# EAGLE design vrnding-mechine (EAGLE 9.5.1)
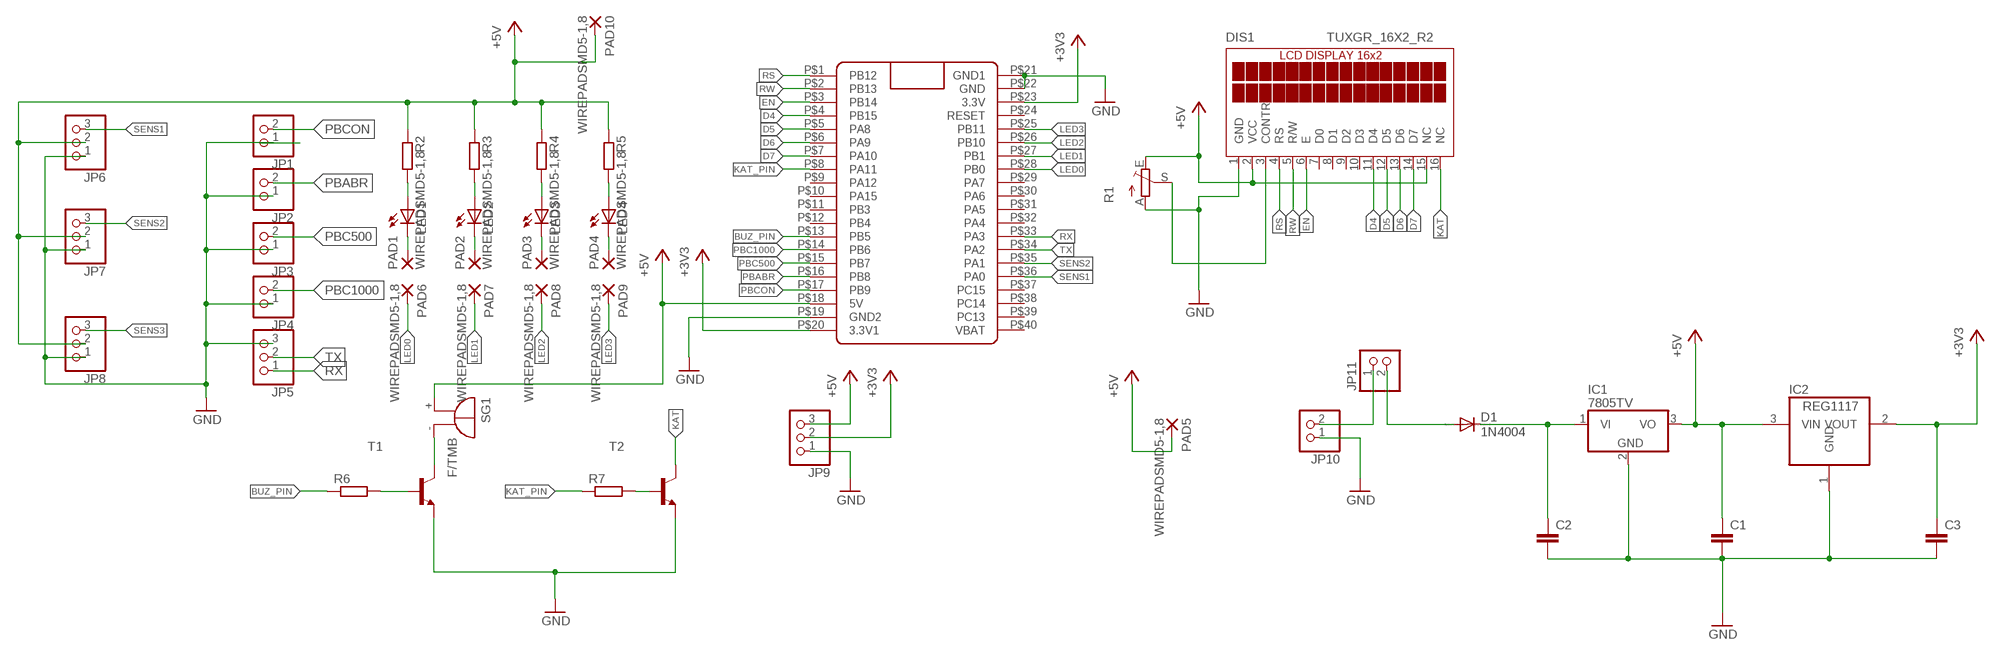
[diagram p0: schematic, sheet 1]

## Parts
C1  C-EU025-030X050  [C025-030X050]
C2  C-EU025-030X050  [C025-030X050]
C3  C-EU025-030X050  [C025-030X050]
D1  1N4004  [DO41-10]
DIS1  TUXGR_16X2_R2  [TUXGR_16X2_R2]
IC1  7805TV  [TO220V]
IC2  REG1117  [SOT223]
JP1  PINHD-1X2  [1X02]
JP2  PINHD-1X2  [1X02]
JP3  PINHD-1X2  [1X02]
JP4  PINHD-1X2  [1X02]
JP5  PINHD-1X3  [1X03]
JP6  PINHD-1X3  [1X03]
JP7  PINHD-1X3  [1X03]
JP8  PINHD-1X3  [1X03]
JP9  PINHD-1X3  [1X03]
JP10  PINHD-1X2  [1X02]
JP11  PINHD-1X2  [1X02]
LED1  LED5MM  [LED5MM]
LED2  LED5MM  [LED5MM]
LED3  LED5MM  [LED5MM]
LED4  LED5MM  [LED5MM]
PAD1  WIREPADSMD5-1,8  [5-1,8]
PAD2  WIREPADSMD5-1,8  [5-1,8]
PAD3  WIREPADSMD5-1,8  [5-1,8]
PAD4  WIREPADSMD5-1,8  [5-1,8]
PAD5  WIREPADSMD5-1,8  [5-1,8]
PAD6  WIREPADSMD5-1,8  [5-1,8]
PAD7  WIREPADSMD5-1,8  [5-1,8]
PAD8  WIREPADSMD5-1,8  [5-1,8]
PAD9  WIREPADSMD5-1,8  [5-1,8]
PAD10  WIREPADSMD5-1,8  [5-1,8]
R1  TRIM_EU-CA6V  [CA6V]
R2  R-EU_0309/10  [0309/10]
R3  R-EU_0309/10  [0309/10]
R4  R-EU_0309/10  [0309/10]
R5  R-EU_0309/10  [0309/10]
R6  R-EU_0309/10  [0309/10]
R7  R-EU_0309/10  [0309/10]
SG1  F/TMB  [F/TMB]
T1  -NPN-TO92-ECB  [TO92-ECB]
T2  -NPN-TO92-ECB  [TO92-ECB]
U$1  BLUE_PILL  [BLUE_PILL]

## Nets
+3V3: C3.1 IC2.2(VOUT) JP9.2 U$1.P$20(3.3V1) U$1.P$23(3.3V)
+5V: C1.1 DIS1.2(VCC) DIS1.15(NC) IC1.3(VO) IC2.3(VIN) JP6.2 JP7.2 JP8.2 JP9.3 PAD5.1(P) PAD10.1(P) R1.E R2.1 R3.1 R4.1 R5.1 SG1.+ U$1.P$18(5V)
BUZ_PIN: R6.1 U$1.P$13(PB5)
D4: DIS1.11(D4) U$1.P$4(PB15)
D5: DIS1.12(D5) U$1.P$5(PA8)
D6: DIS1.13(D6) U$1.P$6(PA9)
D7: DIS1.14(D7) U$1.P$7(PA10)
EN: DIS1.6(E) U$1.P$3(PB14)
GND: C1.2 C2.2 C3.2 DIS1.1(GND) IC1.2(GND) IC2.1(GND) JP1.1 JP2.1 JP3.1 JP4.1 JP5.3 JP6.1 JP7.1 JP8.1 JP9.1 JP10.1 R1.A T1.E T2.E U$1.P$19(GND2) U$1.P$21(GND1) U$1.P$22(GND)
KAT: DIS1.16(NC) T2.C
KAT_PIN: R7.1 U$1.P$8(PA11)
LED0: PAD6.1(P) U$1.P$28(PB0)
LED1: PAD7.1(P) U$1.P$27(PB1)
LED2: PAD8.1(P) U$1.P$26(PB10)
LED3: PAD9.1(P) U$1.P$25(PB11)
N$1: DIS1.3(CONTR) R1.S
N$2: SG1.- T1.C
N$3: R6.2 T1.B
N$4: LED1.A R2.2
N$5: LED2.A R3.2
N$6: LED3.A R4.2
N$7: LED4.A R5.2
N$8: R7.2 T2.B
N$9: LED2.K(C) PAD2.1(P)
N$10: LED1.K(C) PAD1.1(P)
N$11: LED3.K(C) PAD3.1(P)
N$12: LED4.K(C) PAD4.1(P)
N$13: JP10.2 JP11.1
N$14: D1.A JP11.2
N$15: C2.1 D1.C IC1.1(VI)
PBABR: JP2.2 U$1.P$16(PB8)
PBC500: JP3.2 U$1.P$15(PB7)
PBC1000: JP4.2 U$1.P$14(PB6)
PBCON: JP1.2 U$1.P$17(PB9)
RS: DIS1.4(RS) U$1.P$1(PB12)
RW: DIS1.5(R/W) U$1.P$2(PB13)
RX: JP5.1 U$1.P$33(PA3)
SENS1: JP6.3 U$1.P$36(PA0)
SENS2: JP7.3 U$1.P$35(PA1)
SENS3: JP8.3
TX: JP5.2 U$1.P$34(PA2)
Unconnected: DIS1.7(D0) DIS1.8(D1) DIS1.9(D2) DIS1.10(D3) U$1.P$9(PA12) U$1.P$10(PA15) U$1.P$11(PB3) U$1.P$12(PB4) U$1.P$24(RESET) U$1.P$29(PA7) U$1.P$30(PA6) U$1.P$31(PA5) U$1.P$32(PA4) U$1.P$37(PC15) U$1.P$38(PC14) U$1.P$39(PC13) U$1.P$40(VBAT)

## Library data of the parts
C1-C3 = rcl:C-EU: CAPACITOR, European symbol; SPICEPREFIX: C
D1 = diode:1N4004: DIODE general purpose rectifier, 1 A
DIS1 = display-lcd:TUXGR_16X2_R2: Tuxgraphics LCD display 16x2 characters reflective, without background light Source: tuxgr_12x2_r2.pdf; OC_FARNELL: unknown; OC_NEWARK: unknown
IC1 = linear:78*: Positive VOLTAGE REGULATOR Source: http://cache.national.com/ds/LM/LM78L05.pdf http://www.fairchildsemi.com/ds/LM/LM7805.pdf
IC2 = burr-brown:REG1117: 800mA and 1A Low Dropout (LDO) Positive Regulator 1.8V, 2.5V, 2.85V, 3.3V, 5V, and Adj; MPN: REG1117; OC_FARNELL: 1097566; OC_NEWARK: 14P6981
JP1-JP4 JP10 JP11 = pinhead:PINHD-1X2: PIN HEADER
JP5-JP9 = pinhead:PINHD-1X3: PIN HEADER
LED1-LED4 = led:LED: LED OSRAM: - CHIPLED LG R971, LG N971, LY N971, LG Q971, LY Q971, LO R971, LY R971 LH N974, LH R974 LS Q976, LO Q976, LY Q976 LO Q996 - Hyper CHIPLED LW Q18S LB Q993, LB Q99A, LB R99A - SideLED LS A670, LO A670, LY A670, LG A670, LP A670 LB A673, LV A673, LT A673, LW A673 LH A674 LY A675 LS A676, LA A676, LO A676, LY A676, LW A676 LS A679, LY A679, LG A679 - Hyper Micro SIDELED® LS Y876, LA Y876, LO Y876, LY Y876 LT Y87S - SmartLED LW L88C, LW L88S LB L89C, LB L89S, LG L890 LS L89K, LO L89K, LY L89K LS L896, LA L896, LO L896, LY L896 - TOPLED LS T670, LO T670, LY T670, LG T670, LP T670 LSG T670, LSP T670, LSY T670, LOP T670, LYG T670 LG T671, LOG T671, LSG T671 LB T673, LV T673, LT T673, LW T673 LH T674 LS T676, LA T676, LO T676, LY T676, LB T676, LH T676, LSB T676, LW T676 LB T67C, LV T67C, LT T67C, LS T67K, LO T67K, LY T67K, LW E67C LS E67B, LA E67B, LO E67B, LY E67B, LB E67C, LV E67C, LT E67C LW T67C LS T679, LY T679, LG T679 LS T770, LO T770, LY T770, LG T770, LP T770 LB T773, LV T773, LT T773, LW T773 LH T774 LS E675, LA E675, LY E675, LS T675 LS T776, LA T776, LO T776, LY T776, LB T776 LHGB T686 LT T68C, LB T68C - Hyper Mini TOPLED® LB M676 - Mini TOPLED Santana® LG M470 LS M47K, LO M47K, LY M47K Source: http://www.osram.convergy.de LUXEON: - LUMILED® LXK2-PW12-R00, LXK2-PW12-S00, LXK2-PW14-U00, LXK2-PW14-V00 LXK2-PM12-R00, LXK2-PM12-S00, LXK2-PM14-U00 LXK2-PE12-Q00, LXK2-PE12-R00, LXK2-PE12-S00, LXK2-PE14-T00, LXK2-PE14-U00 LXK2-PB12-K00, LXK2-PB12-L00, LXK2-PB12-M00, LXK2-PB14-N00, LXK2-PB14-P00, LXK2-PB14-Q00 LXK2-PR12-L00, LXK2-PR12-M00, LXK2-PR14-Q00, LXK2-PR14-R00 LXK2-PD12-Q00, LXK2-PD12-R00, LXK2-PD12-S00 LXK2-PH12-R00, LXK2-PH12-S00 LXK2-PL12-P00, LXK2-PL12-Q00, LXK2-PL12-R00 Source: www.luxeon.com KINGBRIGHT: KA-3528ASYC Source: www.kingbright.com
PAD1-PAD10 = wirepad:WIREPAD: Wire PAD connect wire on PCB
R1 = pot:TRIM_EU-: POTENTIOMETER
R2-R7 = rcl:R-EU_: RESISTOR, European symbol; SPICEPREFIX: R
SG1 = buzzer:F/TMB: BUZZER Source: Buerklin; OC_FARNELL: unknown; OC_NEWARK: unknown
T1 T2 = transistor:*-NPN-: NPN Transistror BF959 corrected 2008.03.06
U$1 = BluePill:BLUE_PILL

## Board
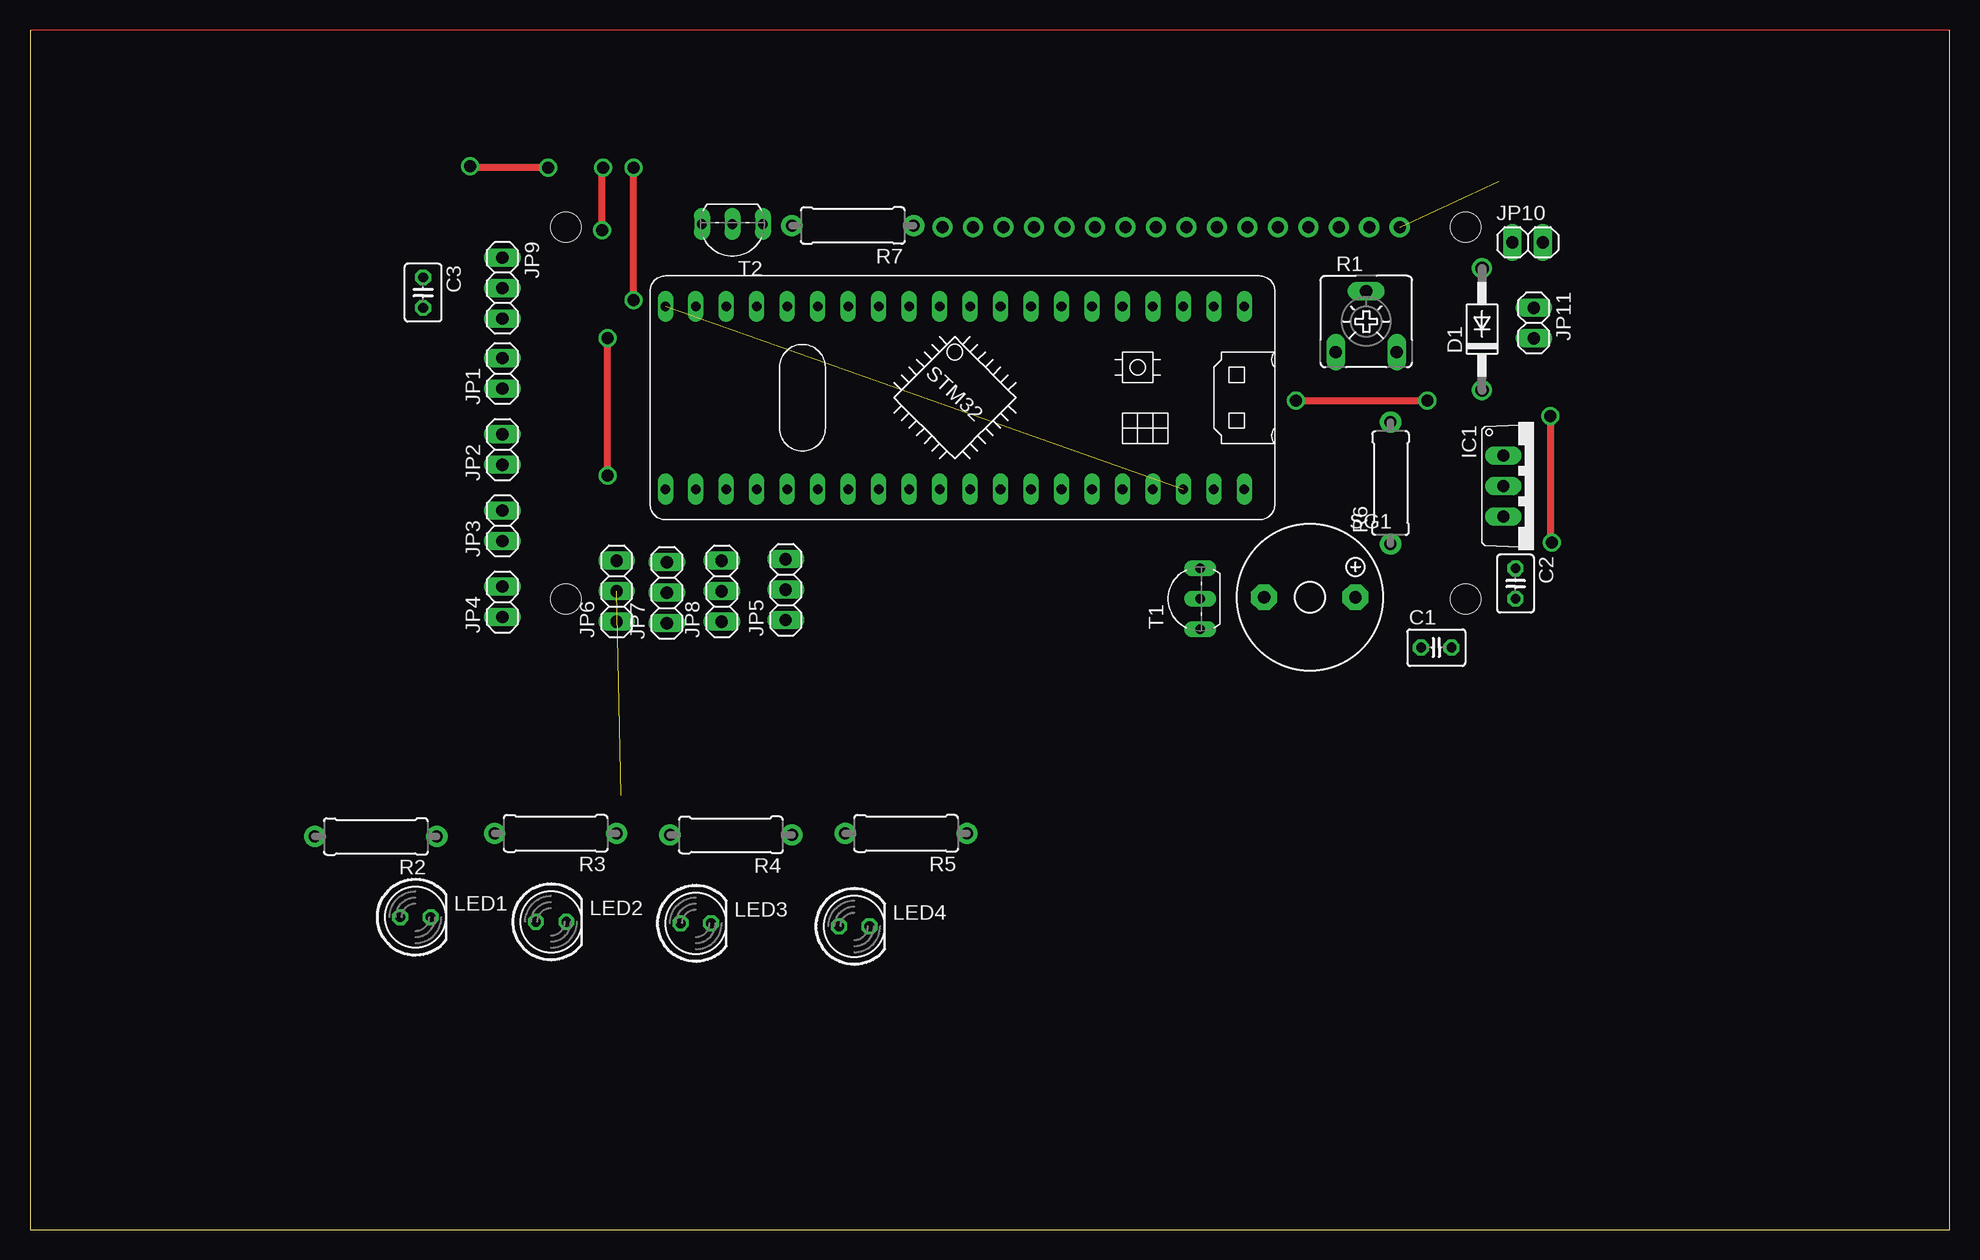
[diagram p1: board, top side]
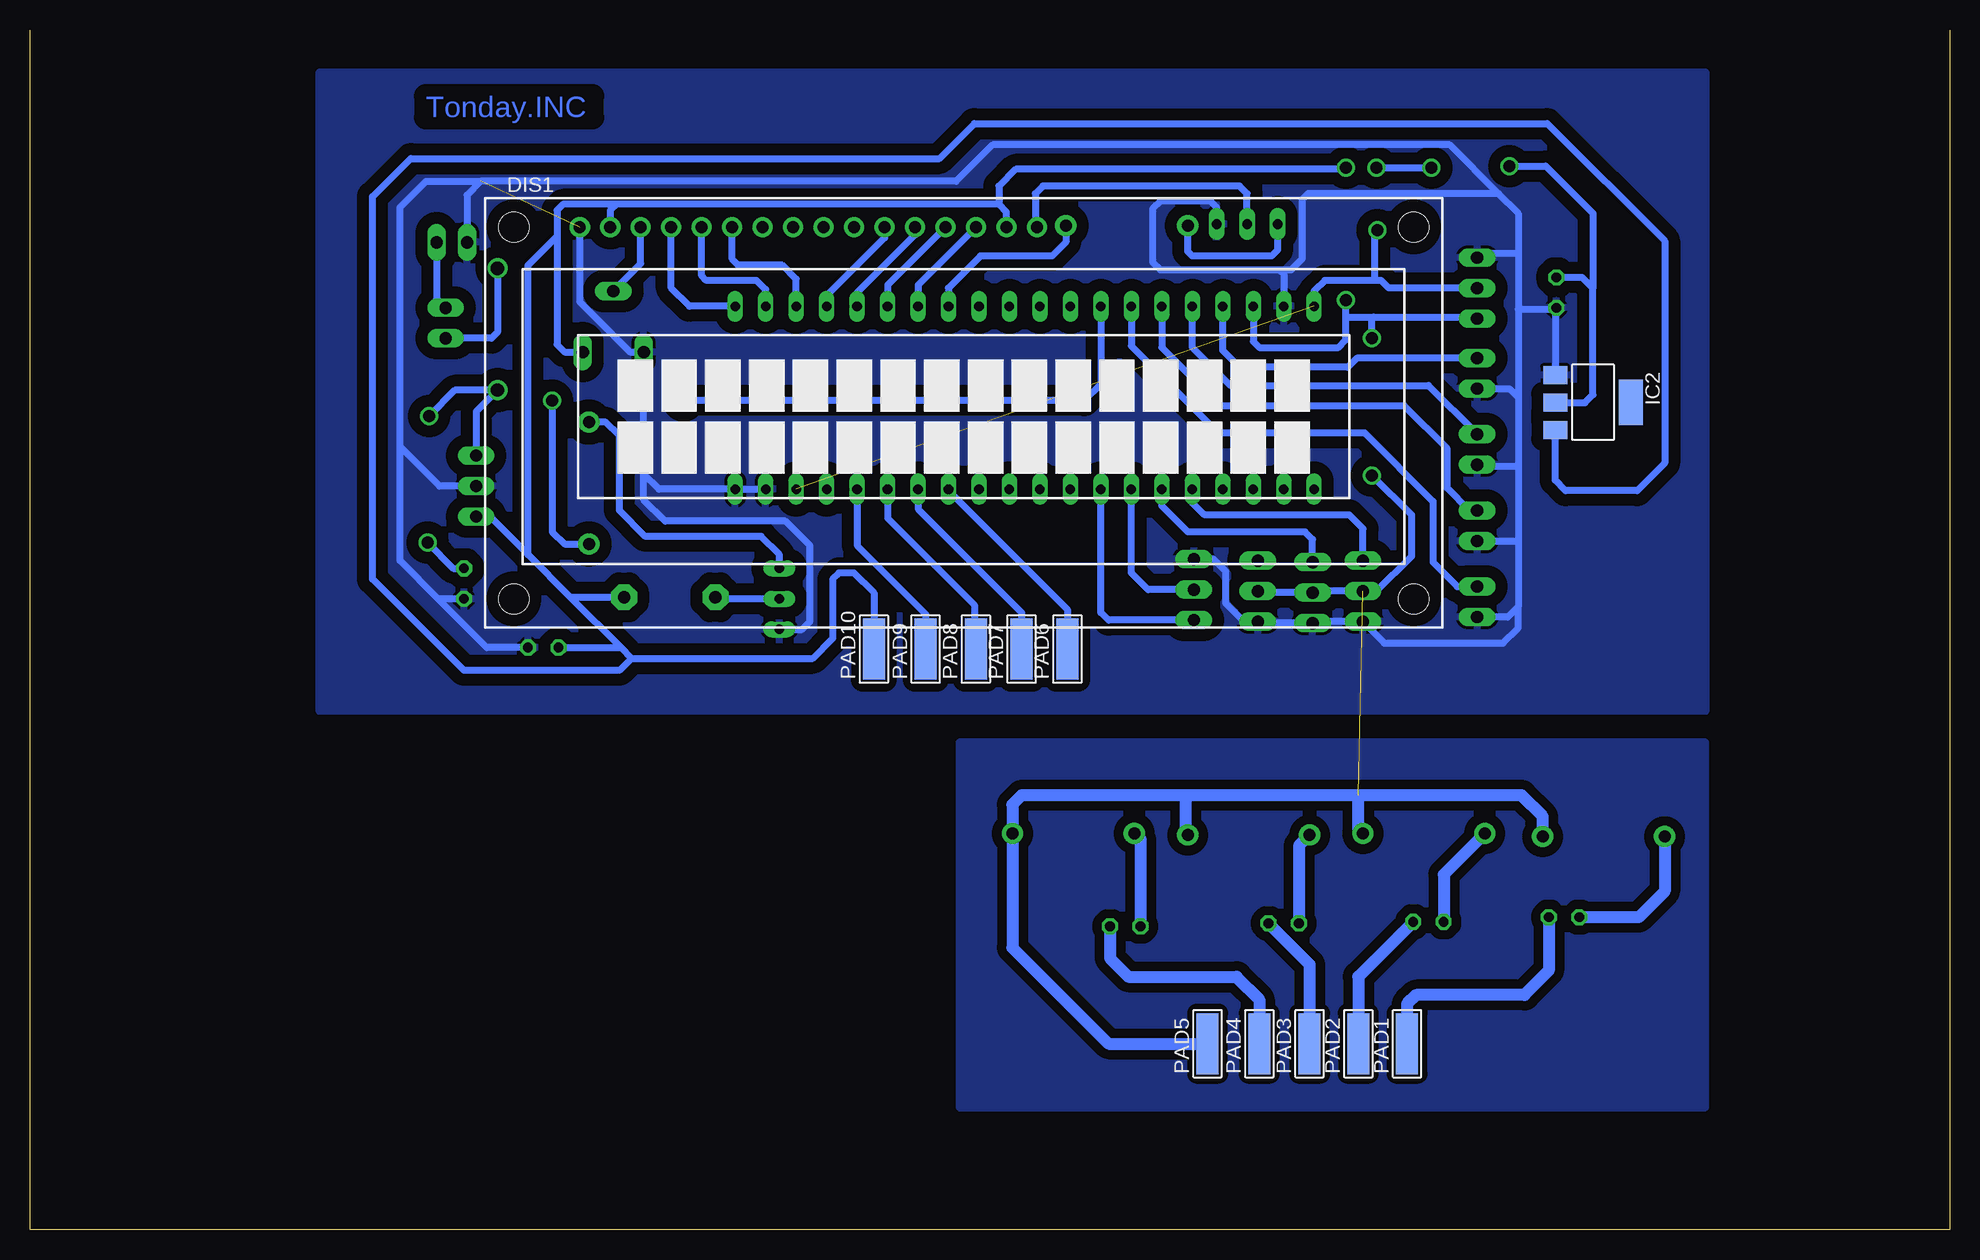
[diagram p2: board, bottom side, seen from below]

Size 160 x 100 mm. Coordinates in mm from the lower left corner, seen from the top.
Outline: 160,100 160,0 0,0 0,100
Copper layers (1*16): Top 0.035mm / dielectric 1.5mm / Bottom 0.035mm
Design rules "default": minimum track width 6mil, minimum drill 0.35mm, track to track 6mil, track to pad 6mil, pad to pad 6mil, via to via 6mil, smd to smd 6mil, copper to edge 40mil, drill to drill 6mil, minimum pad ring 10mil, minimum via ring 8mil, stop-mask expansion 4mil, vias tented up to drill 0mil, thermal gap 10mil

### Footprints (pad centres in the part's own frame; a part is rotated, then mirrored left to right if it is on the bottom)
C025-030X050 = drill 0.813 octagon: 1 -1.27,0; 2 1.27,0
DO41-10 = drill 1.118: A 5.08,0; C -5.08,0
TUXGR_16X2_R2 = drill 1 pad 1.676: 1 -32,15.5; 2 -29.46,15.5; 3 -26.92,15.5; 4 -24.38,15.5; 5 -21.84,15.5; 6 -19.3,15.5; 7 -16.76,15.5; 8 -14.22,15.5; 9 -11.68,15.5; 10 -9.14,15.5; 11 -6.6,15.5; 12 -4.06,15.5; 13 -1.52,15.5; 14 1.02,15.5; 15 3.56,15.5; 16 6.1,15.5 | hole 2.5: -37.5,-15.5; 37.5,-15.5; -37.5,15.5; 37.5,15.5
TO220V = drill 1.016 long: 1 -2.54,-2.54; 2 0,-2.54; 3 2.54,-2.54
SOT223 = smd 1.499 x 2.007: 1 -2.261,-3.15; 2 0.025,-3.15; 3 2.311,-3.15 | smd 3.81 x 2.007: 4 0,3.15
1X02 = drill 1.016 long: 1 -1.27,0; 2 1.27,0
1X03 = drill 1.016 long: 1 -2.54,0; 2 0,0; 3 2.54,0
LED5MM = drill 0.813 octagon: A -1.27,0; K 1.27,0
5-1,8 = smd 1.829 x 5.08: 1 0,0
CA6V = drill 1.016 long: A -2.54,-2.54; E 2.54,-2.54; S 0,2.54
0309/10 = drill 1 pad 1.778: 1 -5.08,0; 2 5.08,0
F/TMB = drill 1.016 pad 2.159 octagon: + 3.81,0; - -3.81,0
TO92-ECB = drill 0.813 long: B 2.54,0; C 0,0; E -2.54,0
BLUE_PILL = drill 0.8 long: P$1 -7.62,15.24; P$2 -7.62,12.7; P$3 -7.62,10.16; P$4 -7.62,7.62; P$5 -7.62,5.08; P$6 -7.62,2.54; P$7 -7.62,0; P$8 -7.62,-2.54; P$9 -7.62,-5.08; P$10 -7.62,-7.62; P$11 -7.62,-10.16; P$12 -7.62,-12.7; P$13 -7.62,-15.24; P$14 -7.62,-17.78; P$15 -7.62,-20.32; P$16 -7.62,-22.86; P$17 -7.62,-25.4; P$18 -7.62,-27.94; P$19 -7.62,-30.48; P$20 -7.62,-33.02; P$21 7.62,15.24; P$22 7.62,12.7; P$23 7.62,10.16; P$24 7.62,7.62; P$25 7.62,5.08; P$26 7.62,2.54; P$27 7.62,0; P$28 7.62,-2.54; P$29 7.62,-5.08; P$30 7.62,-7.62; P$31 7.62,-10.16; P$32 7.62,-12.7; P$33 7.62,-15.24; P$34 7.62,-17.78; P$35 7.62,-20.32; P$36 7.62,-22.86; P$37 7.62,-25.4; P$38 7.62,-27.94; P$39 7.62,-30.48; P$40 7.62,-33.02

### Placement (x,y rotation side)
C1  117.22,48.51 0 top
C2  123.83,53.85 270 top
C3  32.77,78.11 270 top
D1  121.03,75.06 90 top
DIS1  82.17,68.07 0 bottom
IC1  125.35,61.98 270 top
IC2  29.72,68.96 270 bottom
JP1  39.37,71.37 90 top
JP2  39.37,65.02 90 top
JP3  39.37,58.67 90 top
JP4  39.37,52.32 90 top
JP5  62.99,53.34 90 top
JP6  48.9,53.21 90 top
JP7  53.09,53.09 90 top
JP8  57.66,53.21 90 top
JP9  39.37,78.49 270 top
JP10  124.84,82.3 0 top
JP11  125.35,75.56 270 top
LED1  32.13,26.04 0 top
LED2  43.43,25.65 0 top
LED3  55.5,25.53 0 top
LED4  68.71,25.27 0 top
PAD1  45.21,15.49 0 bottom
PAD2  49.28,15.49 0 bottom
PAD3  53.34,15.49 0 bottom
PAD4  57.53,15.49 0 bottom
PAD5  61.85,15.49 0 bottom
PAD6  73.53,48.39 0 bottom
PAD7  77.34,48.39 0 bottom
PAD8  81.15,48.39 0 bottom
PAD9  85.34,48.39 0 bottom
PAD10  89.66,48.39 0 bottom
R1  111.38,75.69 0 top
R2  28.83,32.77 180 top
R3  43.81,33.02 180 top
R4  58.42,32.89 180 top
R5  73.03,33.02 180 top
R6  113.41,62.23 90 top
R7  68.58,83.69 180 top
SG1  106.68,52.7 0 top
T1  97.54,52.58 90 top
T2  58.55,83.82 180 top
U$1  85.98,69.34 270 top

### Tracks (layer width: path | path; a pad name or v marks a point on that pad's centre or on a via)
+3V3  (via drill 1 pad 1)  (1 unrouted)
  Top 0.6: v47.69,83.31 47.69,88.45 v47.75,88.52 | v43.18,88.52 36.83,88.52 v36.7,88.65
  Bottom 0.6: U$1.P$20 52.96,78.23 52.07,79.12 47.88,79.12 | JP9.2 46.74,78.49 47.37,79.12 47.88,79.12 | IC2.2 30.38,68.94 29.72,69.6 29.72,78.49 | 29.72,78.49 30.61,79.38 C3.1 | 47.88,79.12 47.88,83.12 v47.69,83.31 | v47.75,88.52 v43.18,88.52 | v36.7,88.65 33.66,88.65 29.72,84.71 29.72,78.49
+5V  (via drill 1 pad 1)  (1 unrouted)
  Top 0.6: v50.29,77.47 v50.29,88.52 | v48.13,62.87 v48.13,74.3
  Bottom 0.6: DIS1.15 78.61,84.83 79.25,85.47 | 79.25,85.47 111.12,85.47 | 111.12,85.47 111.63,84.96 DIS1.2 | 111.12,85.47 115.57,85.47 116.08,84.96 116.08,82.8 | 116.08,82.8 116.08,73.79 115.44,73.15 R1.E | U$1.P$18 58.04,74.04 57.53,73.53 50.93,73.53 50.29,74.17 50.29,76.07 | 79.25,85.47 79.25,87 77.85,88.39 50.42,88.39 v50.29,88.52 | v48.13,62.87 44.83,59.56 44.83,56.13 47.75,53.21 JP6.2 52.96,53.21 JP7.2 57.53,53.09 JP8.2 | 50.29,76.07 v50.29,77.47 | 50.29,76.07 48.01,76.07 | 48.01,76.07 39.5,76.07 JP9.3 | v48.13,74.3 48.13,75.95 48.01,76.07 | SG1.+ 114.94,52.7 | 116.08,82.8 118.49,80.39 118.49,56.26 | 114.94,52.7 118.49,56.26 | 114.94,52.7 110.74,48.51 | 109.86,47.62 94.74,47.62 93.09,49.28 93.09,54.23 92.58,54.74 91.31,54.74 89.66,53.09 PAD10.1 | IC1.3 121.67,59.44 118.49,56.26 | C1.1 110.74,48.51 | 110.74,48.51 109.86,47.62 | 109.86,47.62 110.87,46.61 123.83,46.61 131.44,54.23 131.44,86.11 128.27,89.28 84.2,89.28 81.28,92.2 33.53,92.2 23.75,82.42 23.75,63.88 26.04,61.59 32,61.59 32.87,62.46 IC2.3
  Bottom 1: R2.1 33.91,34.42 35.69,36.2 49.28,36.2 | 49.28,36.2 63.63,36.2 | 63.63,36.2 77.34,36.2 78.11,35.43 R5.1 78.11,23.5 70.1,15.49 PAD5.1 | R3.1 49.28,33.4 49.28,36.2 | R4.1 63.63,33.02 63.63,36.2
BUZ_PIN  (via drill 1 pad 1)
  Top 0.6: v105.54,69.09 v116.46,69.09
  Bottom 0.6: U$1.P$13 70.74,70.48 72.14,69.09 v105.54,69.09 | v116.46,69.09 116.46,58.17 115.44,57.15 R6.1
D4
  Bottom 0.6: DIS1.11 88.77,82.68 93.6,77.85 U$1.P$4
D5
  Bottom 0.6: DIS1.12 86.23,82.94 91.06,78.11 U$1.P$5
D6
  Bottom 0.6: DIS1.13 88.52,78.74 U$1.P$6
D7
  Bottom 0.6: DIS1.14 85.98,78.74 U$1.P$7
EN
  Bottom 0.6: U$1.P$3 96.14,79.25 97.28,80.39 100.97,80.39 101.47,80.9 DIS1.6
GND  (1 unrouted)
  Bottom 0.6: U$1.P$22 U$1.P$21 107.57,61.72 108.84,62.99 | 108.84,62.99 R1.A 109.98,73.15 114.17,77.34 DIS1.1 | T2.E 61.09,85.22 61.59,85.72 65.79,85.72 66.42,85.09 66.42,80.64 65.79,80.01 55.88,80.01 | 55.88,80.01 55.5,79.63 U$1.P$19 | JP1.1 36.7,70.1 35.94,69.34 | 35.94,69.34 35.94,63.63 | 35.94,63.63 35.94,57.4 | 35.94,57.4 35.94,51.94 | 35.94,51.94 36.83,51.05 JP4.1 | JP3.1 35.94,57.4 | JP2.1 39.24,63.63 35.94,63.63 | 55.88,80.01 54.86,80.01 53.98,80.9 53.98,85.85 53.47,86.36 37.59,86.36 | 37.59,86.36 35.94,84.71 35.94,81.41 | 35.94,81.41 35.94,76.71 | 35.94,76.71 35.94,69.34 | 35.94,51.94 35.94,50.16 37.21,48.9 47.12,48.9 JP6.1 52.96,50.67 JP7.1 57.53,50.55 JP8.1 58.8,50.67 60.33,52.2 60.33,54.86 61.34,55.88 JP5.3 | JP9.1 38.99,81.41 35.94,81.41 | T1.E 95.63,50.04 95,50.67 95,57.02 97.03,59.05 107.06,59.05 108.84,60.83 108.84,62.99 | 37.59,86.36 41.66,90.42 79.76,90.42 82.8,87.38 122.43,87.38 | 122.43,87.38 123.57,86.23 JP10.1 | IC1.2 125.86,61.98 129.16,65.28 | 129.16,65.28 129.16,85.22 127,87.38 122.43,87.38 | C2.2 125.98,52.58 | 129.16,65.28 129.16,55.75 125.98,52.58 | C1.2 121.92,48.51 125.98,52.58 | 35.94,76.71 32.89,76.71 C3.2 32.87,76.73 IC2.1
  pour Bottom (isolate 1): 20.32,95.25 20.32,43.18 135.89,43.18 135.89,96.52 20.32,96.52
KAT
  Bottom 0.6: T2.C 58.55,86.36 59.18,87 75.56,87 76.2,86.36 76.2,83.7 DIS1.16
KAT_PIN
  Bottom 0.6: R7.1 73.66,82.3 74.8,81.15 80.77,81.15 83.44,78.49 U$1.P$8
LED0
  Bottom 0.6: U$1.P$28 83.44,61.59 73.53,51.69 PAD6.1
LED1
  Bottom 0.6: U$1.P$27 85.98,60.07 77.34,51.44 PAD7.1
LED2
  Bottom 0.6: U$1.P$26 88.52,59.31 81.28,52.07 81.28,48.51 PAD8.1
LED3
  Bottom 0.6: U$1.P$25 91.06,57.02 85.34,51.31 PAD9.1
N$1
  Bottom 0.6: R1.S 109.09,80.52 DIS1.3
N$2
  Bottom 0.6: T1.C 102.74,52.58 SG1.-
N$3
  Bottom 0.6: T1.B 97.54,56.26 99.06,57.78 108.71,57.78 110.87,59.94 110.87,66.17 112.01,67.31 R6.2
N$4
  Bottom 1: R2.2 23.75,28.19 25.91,26.04 LED1.A
N$5
  Bottom 1: R3.2 42.16,29.59 LED2.A
N$6
  Bottom 1: R4.2 54.23,32 LED3.A
N$7
  Bottom 1: R5.2 67.44,32.51 LED4.A
N$8
  Bottom 0.6: T2.B 56.01,81.66 56.52,81.15 63.12,81.15 63.5,81.53 R7.2
N$9
  Bottom 1: LED2.K 49.28,21.08 PAD2.1
N$10
  Bottom 0.6: 45.21,14.86 PAD1.1
  Bottom 1: LED1.K 33.4,21.59 35.43,19.56 44.45,19.56 45.21,18.8 PAD1.1
N$11
  Bottom 1: LED3.K 53.34,22.1 PAD3.1
N$12
  Bottom 1: LED4.K 69.98,22.61 68.45,21.08 59.44,21.08 57.53,19.18 PAD4.1
N$13
  Bottom 0.6: JP10.2 126.11,77.6 JP11.1
N$14
  Bottom 0.6: D1.A 121.03,74.8 121.54,74.3 JP11.2
N$15  (via drill 1 pad 1)
  Top 0.6: v126.75,67.82 126.75,57.4 v126.87,57.28
  Bottom 0.6: v126.75,67.82 124.59,69.98 D1.C 122.81,68.2 IC1.1 | v126.87,57.28 124.71,55.12 C2.1
N$16
  Top 0: 160,100 0,100
OUTLINE
  pour Bottom (isolate 0.8): 20.32,40.64 82.55,40.64 82.55,10.16 20.32,10.16
PBABR
  Bottom 0.6: JP2.2 43.43,70.36 59.94,70.36 63.12,73.53 U$1.P$16
PBC500
  Bottom 0.6: U$1.P$15 65.66,73.53 60.83,68.71 45.47,68.71 41.91,65.15 41.91,61.85 40.01,59.94 JP3.2
PBC1000
  Bottom 0.6: U$1.P$14 68.2,73.66 60.96,66.42 48.77,66.42 43.05,60.71 43.05,55.63 41.02,53.59 JP4.2
PBCON
  Bottom 0.6: JP1.2 49.4,72.64 50.16,71.88 59.18,71.88 60.58,73.28 U$1.P$17
RS
  Bottom 0.6: U$1.P$1 105.03,76.96 106.55,78.49 DIS1.4
RW
  Bottom 0.6: U$1.P$2 98.68,78.36 99.44,79.12 103.63,79.12 104.01,79.5 104.01,79.51 DIS1.5
RX
  Bottom 0.6: JP5.1 70.1,50.8 70.74,51.44 U$1.P$33
SENS1
  Bottom 0.6: JP6.3 48.9,58.42 50.04,59.56 62.1,59.56 63.12,60.58 U$1.P$36
SENS2
  Bottom 0.6: JP7.3 53.09,57.53 53.72,58.17 63.5,58.17 65.66,60.33 U$1.P$35
TX
  Bottom 0.6: JP5.2 66.8,53.34 68.2,54.74 U$1.P$34

### Text on the board
Bottom: Tonday.INC